# EAGLE schematic 7segement2digits1badidea-mk-4.1 (EAGLE 6.5.0)
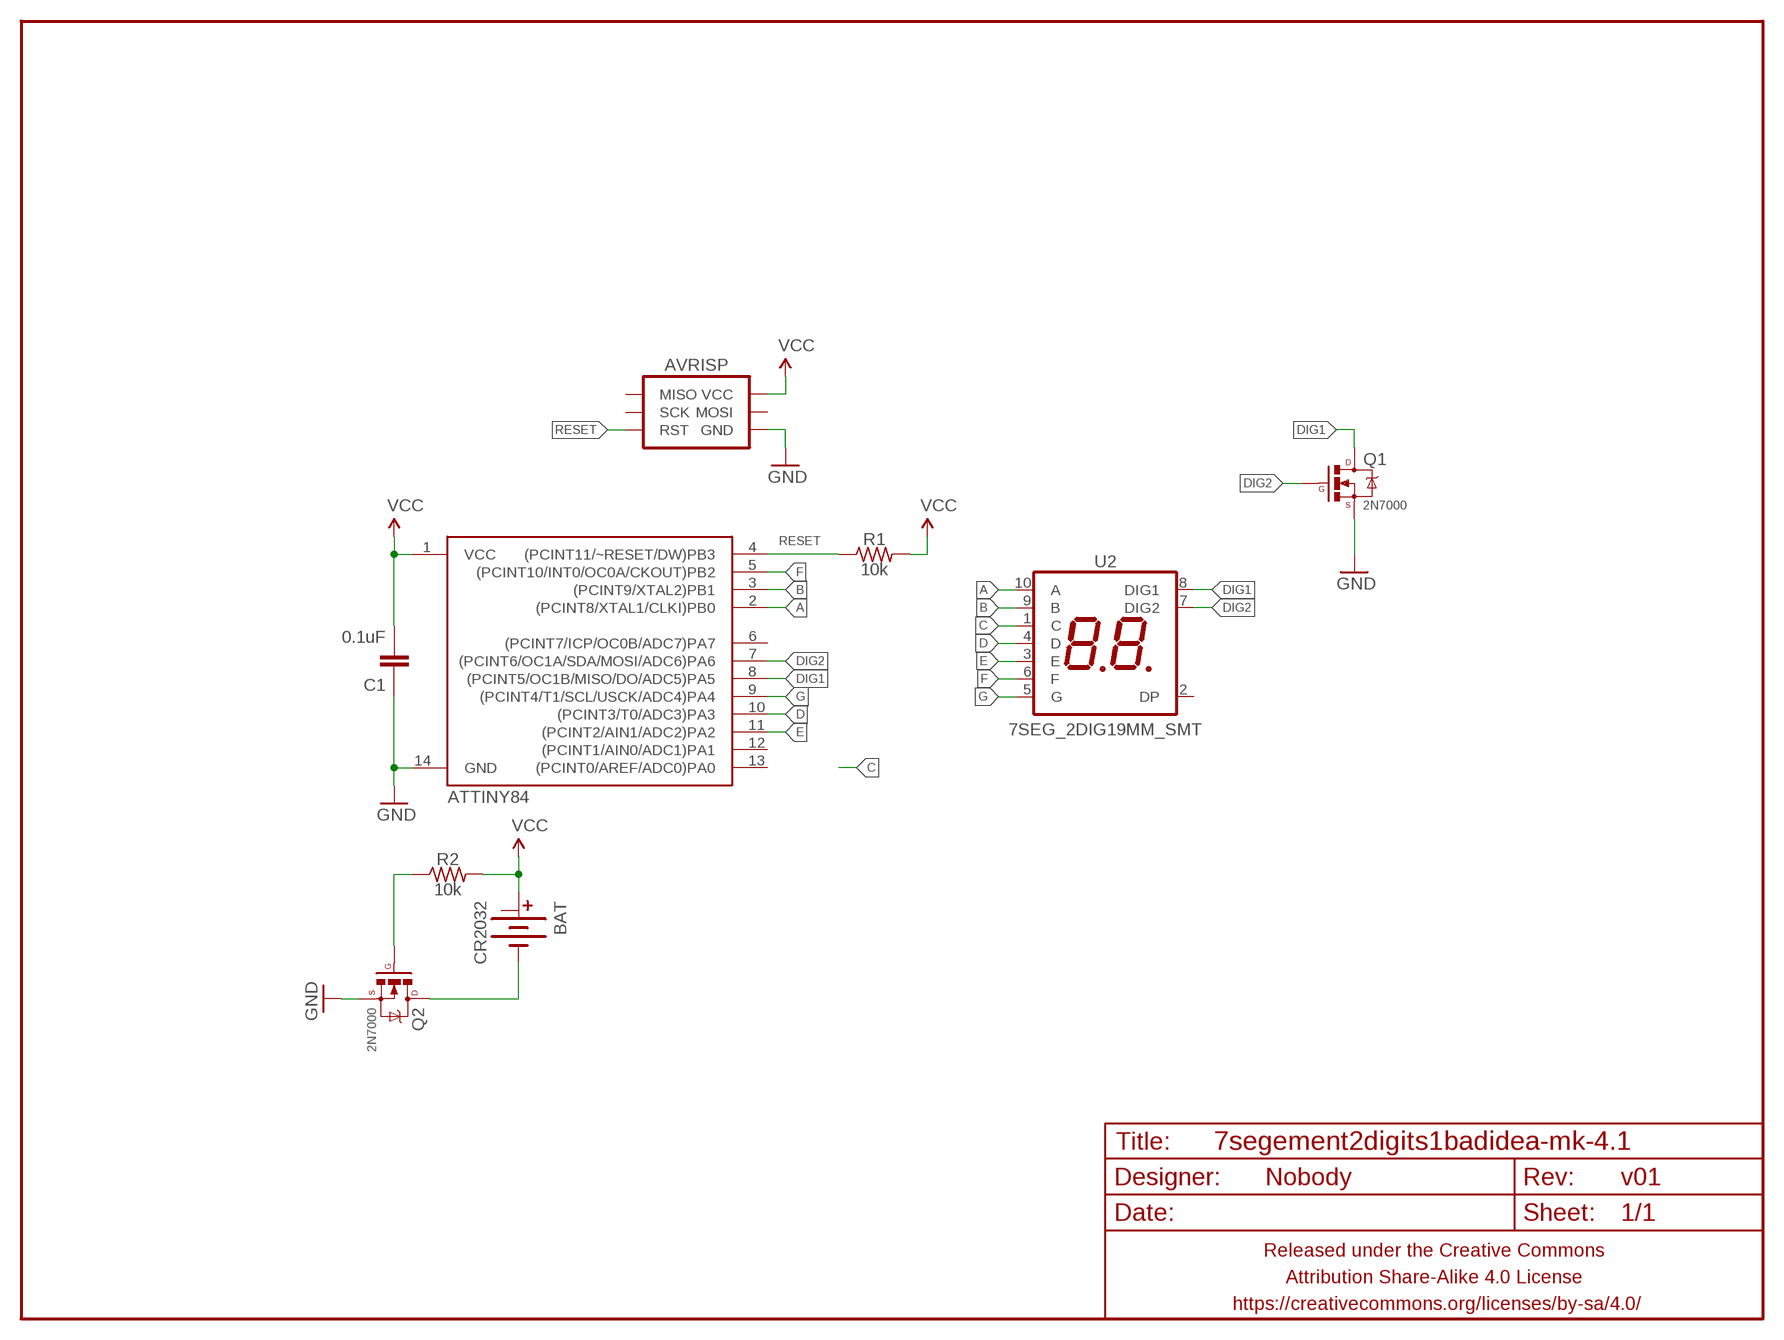
[diagram p0: schematic, sheet 1]

## Parts
AVRISP  AVR_SPI_PRG_6PTH  [2X3]
BAT  CR2032  BATTERY-COINCR2032_SMD_TIGHT  [BATTCON_20MM_MINE_STAHPIT]
C1  0.1uF  CAPACITOR-CERAMICC0805  [C0805]
FRAME1  FRAME-LETTERNO_PACKAGE  [DUMMY]
Q1  2N7000  MOSFET-NCHANNELBSS123LT1G  [SOT23]
Q2  2N7000  MOSFET-NCHANNELBSS123LT1G  [SOT23]
R1  10k  RESISTORR0805  [R0805]
R2  10k  RESISTORR0805  [R0805]
U1  ATTINY84  [SO14]
U2  7SEG_2DIG19MM_SMT  [7SEG_2DIG_19MM_SMT]

## Nets
A: U1.2((PCINT8/XTAL1/CLKI)PB0) U2.10(A)
B: U1.3((PCINT9/XTAL2)PB1) U2.9(B)
C: U2.1(C)
D: U1.10((PCINT3/T0/ADC3)PA3) U2.4(D)
DIG1: Q1.3(D) U1.8((PCINT5/OC1B/MISO/DO/ADC5)PA5) U2.8(DIG1)
DIG2: Q1.1(G) U1.7((PCINT6/OC1A/SDA/MOSI/ADC6)PA6) U2.7(DIG2)
E: U1.11((PCINT2/AIN1/ADC2)PA2) U2.3(E)
F: U1.5((PCINT10/INT0/OC0A/CKOUT)PB2) U2.6(F)
G: U1.9((PCINT4/T1/SCL/USCK/ADC4)PA4) U2.5(G)
GND: AVRISP.6(GND) C1.1 Q1.2(S) Q2.2(S) U1.14(GND)
N$1: Q2.1(G) R2.1
N$2: BAT.BOTTOM(-) Q2.3(D)
RESET: AVRISP.5(RST) R1.1 U1.4((PCINT11/~RESET/DW)PB3)
VCC: AVRISP.2(VCC) BAT.TOP@1(+) C1.2 R1.2 R2.2 U1.1(VCC)
Unconnected: AVRISP.1(MISO) AVRISP.3(SCK) AVRISP.4(MOSI) BAT.TOP@2(+1) U1.6((PCINT7/ICP/OC0B/ADC7)PA7) U1.12((PCINT1/AIN0/ADC1)PA1) U1.13((PCINT0/AREF/ADC0)PA0) U2.2(DP)

## Library data of the parts
AVRISP = A_butts:AVR_SPI_PRG_6: AVR ISP 6 Pin This is the reduced ISP connector for AVR programming. Common on Arduino. This footprint will take up less PCB space and can be used with a 10-pin to 6-pin adapter such as SKU: BOB-08508 **Special note about "TEST_POINT" package. The stop mask is on the top side, so if you want your programming test points to be on the bottom of your board, make sure to place this package on the bottom side of the board. This also ensure that the orientation to program from the bottom side will be correct.
BAT = A_butts:BATTERY-COIN
C1 = A_butts:CAPACITOR-CERAMIC: CAPACITOR, European symbol
FRAME1 = A_butts:FRAME-LETTER: Schematic Frame Standard 8.5x11 US Letter frame; DESIGNER: Nobody; VERSION: v01
Q1 Q2 = A_butts:MOSFET-NCHANNEL: Common NMOSFET Parts MFG P/N Store ID Prod ID FDD8780 TRANS-09984 SI7820DN TRANS-11055 FDS6630A IC-08089 2N7002PW TRANS-11151 FQP30N06L COM-10213 TRANS-10060 BSS123LT1G TRANS-08345 BSS138 TRANS-00830 BS170 2N7000; PROD_ID: TRANS-08345
R1 R2 = A_butts:RESISTOR: RESISTOR, American symbol
U1 = SparkFun-DigitalIC:ATTINY84: Atmel 14-pin 2/4/8kB flash uC; PROD_ID: IC-11285
U2 = A_butts:7SEG_2DIG